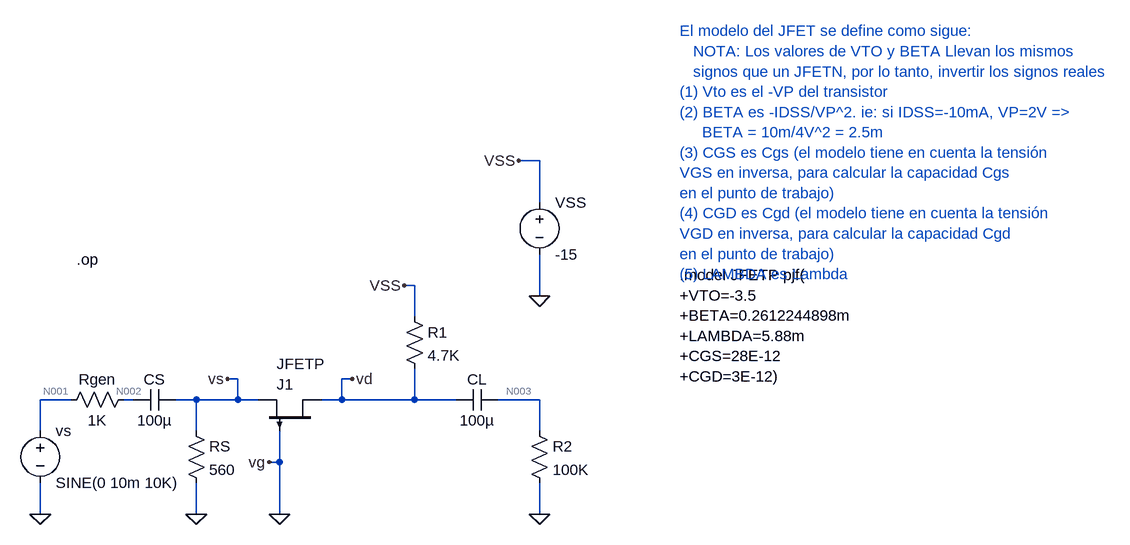
[diagram p0: schematic JFETP.asc]
JFETP.asc, the LTspice schematic file:
Version 4
SHEET 1 1416 680
WIRE 336 96 304 96
WIRE 336 160 336 96
WIRE 144 288 128 288
WIRE 336 304 336 240
WIRE 144 336 144 288
WIRE -128 432 -144 432
WIRE 48 432 32 432
WIRE -384 464 -432 464
WIRE -288 464 -304 464
WIRE -192 464 -224 464
WIRE -128 464 -128 432
WIRE -128 464 -192 464
WIRE -96 464 -128 464
WIRE 32 464 32 432
WIRE 32 464 0 464
WIRE 144 464 144 416
WIRE 144 464 32 464
WIRE 208 464 144 464
WIRE 336 464 272 464
WIRE -432 512 -432 464
WIRE -192 512 -192 464
WIRE 336 512 336 464
WIRE -64 560 -64 512
WIRE -64 560 -80 560
WIRE -432 640 -432 592
WIRE -192 640 -192 592
WIRE -64 640 -64 560
WIRE 336 640 336 592
FLAG -80 560 vg
FLAG -144 432 vs
FLAG 48 432 vd
FLAG -192 640 0
FLAG -64 640 0
FLAG 336 640 0
FLAG 336 304 0
FLAG 304 96 VSS
FLAG 128 288 VSS
FLAG -432 640 0
SYMBOL pjf 0 512 M270
WINDOW 0 72 68 VLeft 2
WINDOW 3 103 68 VLeft 2
SYMATTR InstName J1
SYMATTR Value JFETP
SYMBOL res -208 496 R0
SYMATTR InstName RS
SYMATTR Value 560
SYMBOL res 128 320 R0
SYMATTR InstName R1
SYMATTR Value 4.7K
SYMBOL cap 272 448 R90
WINDOW 0 0 32 VBottom 2
WINDOW 3 32 32 VTop 2
SYMATTR InstName CL
SYMATTR Value 100µ
SYMBOL res 320 496 R0
SYMATTR InstName R2
SYMATTR Value 100K
SYMBOL voltage 336 144 R0
WINDOW 123 0 0 Left 0
WINDOW 39 0 0 Left 0
SYMATTR InstName VSS
SYMATTR Value -15
SYMBOL cap -224 448 R90
WINDOW 0 0 32 VBottom 2
WINDOW 3 32 32 VTop 2
SYMATTR InstName CS
SYMATTR Value 100µ
SYMBOL res -288 448 R90
WINDOW 0 0 56 VBottom 2
WINDOW 3 32 56 VTop 2
SYMATTR InstName Rgen
SYMATTR Value 1K
SYMBOL voltage -432 496 R0
WINDOW 123 0 0 Left 0
WINDOW 39 0 0 Left 0
SYMATTR InstName vs
SYMATTR Value SINE(0 10m 10K)
TEXT 552 272 Left 2 !.model JFETP pjf(\n+VTO=-3.5\n+BETA=0.2612244898m\n+LAMBDA=5.88m\n+CGS=28E-12\n+CGD=3E-12)
TEXT 552 -104 Left 2 ;El modelo del JFET se define como sigue:\n   NOTA: Los valores de VTO y BETA Llevan los mismos\n   signos que un JFETN, por lo tanto, invertir los signos reales\n(1) Vto es el -VP del transistor\n(2) BETA es -IDSS/VP^2. ie: si IDSS=-10mA, VP=2V =>\n     BETA = 10m/4V^2 = 2.5m\n(3) CGS es Cgs (el modelo tiene en cuenta la tensión \nVGS en inversa, para calcular la capacidad Cgs \nen el punto de trabajo)\n(4) CGD es Cgd (el modelo tiene en cuenta la tensión \nVGD en inversa, para calcular la capacidad Cgd \nen el punto de trabajo)\n(5) LAMBDA es Lambda
TEXT -376 248 Left 2 !.op

The netlist it stands for:
* JFETP.asc
J1 vd 0 vs JFETP
RS vs 0 560
R1 VSS vd 4.7K
CL N003 vd 100µ
R2 N003 0 100K
VSS VSS 0 -15
CS vs N002 100µ
Rgen N002 N001 1K
vs N001 0 SINE(0 10m 10K)
.model NJF NJF
.model PJF PJF
.lib standard.jft
.model JFETP pjf(
+VTO=-3.5
+BETA=0.2612244898m
+LAMBDA=5.88m
+CGS=28E-12
+CGD=3E-12)
* El modelo del JFET se define como sigue:
*    NOTA: Los valores de VTO y BETA Llevan los mismos
*    signos que un JFETN, por lo tanto, invertir los signos reales
* (1) Vto es el -VP del transistor
* (2) BETA es -IDSS/VP^2. ie: si IDSS=-10mA, VP=2V =>
*      BETA = 10m/4V^2 = 2.5m
* (3) CGS es Cgs (el modelo tiene en cuenta la tensión
* VGS en inversa, para calcular la capacidad Cgs
* en el punto de trabajo)
* (4) CGD es Cgd (el modelo tiene en cuenta la tensión
* VGD en inversa, para calcular la capacidad Cgd
* en el punto de trabajo)
* (5) LAMBDA es Lambda
.op
.backanno
.end

* Results of the author's LTspice run, read from the files saved beside the schematic
* Operating Point:
*   V(vd) = -6.865 V
*   V(vs) = -969.3 mV
*   V(vss) = -15 V
*   V(n003) = -68.65 pV
*   V(n002) = -96.93 fV
*   V(n001) = 0 V
*   I(Cs) = 0 A
*   I(Cl) = 0 A
*   Id(J1) = -1.731 mA
*   Ig(J1) = 7.854 pA
*   Is(J1) = 1.731 mA
*   I(Rgen) = 0 A
*   I(R2) = 0 A
*   I(R1) = -1.731 mA
*   I(Rs) = -1.731 mA
*   I(Vs) = 0 A
*   I(Vss) = 1.731 mA
* From the log:
*   Semiconductor Device Operating Points:
*                           --- JFET Transistors ---
*   Name:      j1
*   Model:    jfetp
*   Id:     -1.73e-03
*   Vgs:     9.69e-01
*   Vds:    -5.90e+00
*   Gm:      1.37e-03
*   Gds:     9.84e-06
*   Cgs:     2.00e-11
*   Cgd:     1.07e-12